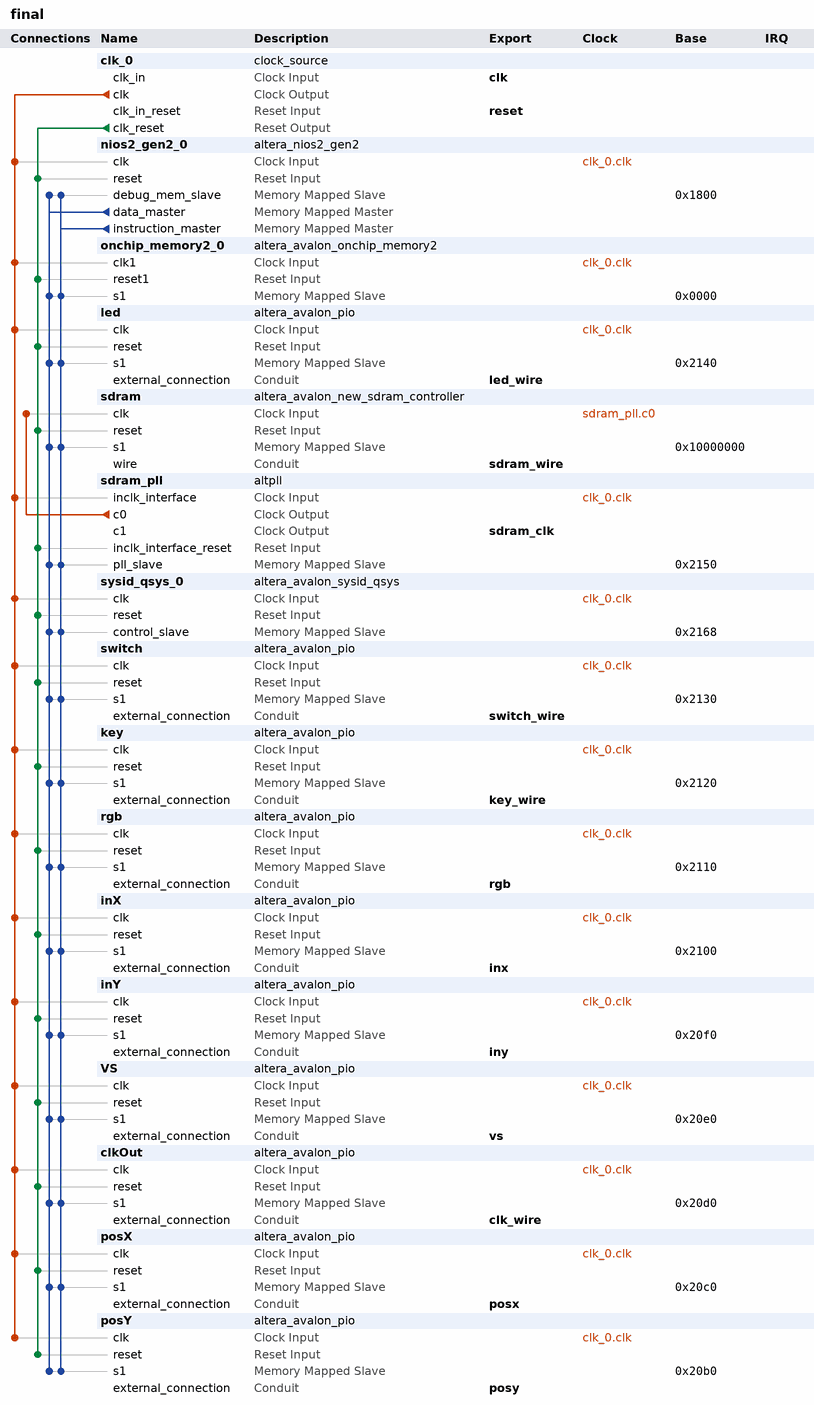
[diagram p0: system contents]
# Platform Designer (Qsys) system final, Cyclone IV E EP4CE115F29C7
# Parameters at their usual value, and those the tool derives, are not listed.
package require -exact qsys 16.1
create_system final
set_project_property DEVICE_FAMILY {Cyclone IV E}
set_project_property DEVICE EP4CE115F29C7

add_instance clk_0 clock_source 16.1
set_instance_parameter_value clk_0 clockFrequency 50000000

add_instance nios2_gen2_0 altera_nios2_gen2 16.1
set_instance_parameter_value nios2_gen2_0 dcache_size 2048
set_instance_parameter_value nios2_gen2_0 exceptionSlave sdram.s1
set_instance_parameter_value nios2_gen2_0 icache_size 4096
set_instance_parameter_value nios2_gen2_0 impl Tiny
set_instance_parameter_value nios2_gen2_0 resetSlave sdram.s1

add_instance onchip_memory2_0 altera_avalon_onchip_memory2 16.1
set_instance_parameter_value onchip_memory2_0 dataWidth 32
set_instance_parameter_value onchip_memory2_0 dualPort false
set_instance_parameter_value onchip_memory2_0 initMemContent true
set_instance_parameter_value onchip_memory2_0 initializationFileName onchip_mem.hex
set_instance_parameter_value onchip_memory2_0 memorySize 4096

add_instance led altera_avalon_pio 16.1
set_instance_parameter_value led direction Output
set_instance_parameter_value led width 8

add_instance sdram altera_avalon_new_sdram_controller 16.1
set_instance_parameter_value sdram TAC 5.5
set_instance_parameter_value sdram TRCD 20.0
set_instance_parameter_value sdram TRP 20.0
set_instance_parameter_value sdram casLatency 3
set_instance_parameter_value sdram columnWidth 10
set_instance_parameter_value sdram dataWidth 32
set_instance_parameter_value sdram generateSimulationModel false
set_instance_parameter_value sdram model single_Micron_MT48LC4M32B2_7_chip
set_instance_parameter_value sdram numberOfBanks 4
set_instance_parameter_value sdram numberOfChipSelects 1
set_instance_parameter_value sdram powerUpDelay 200.0
set_instance_parameter_value sdram refreshPeriod 7.8125
set_instance_parameter_value sdram rowWidth 13

add_instance sdram_pll altpll 16.1
set_instance_parameter_value sdram_pll CLK0_DIVIDE_BY 1
set_instance_parameter_value sdram_pll CLK0_MULTIPLY_BY 1
set_instance_parameter_value sdram_pll CLK1_DIVIDE_BY 1
set_instance_parameter_value sdram_pll CLK1_DUTY_CYCLE 50
set_instance_parameter_value sdram_pll CLK1_MULTIPLY_BY 1
set_instance_parameter_value sdram_pll CLK1_PHASE_SHIFT -3000
set_instance_parameter_value sdram_pll INCLK0_INPUT_FREQUENCY 20000
set_instance_parameter_value sdram_pll PORT_ARESET PORT_UNUSED
set_instance_parameter_value sdram_pll PORT_LOCKED PORT_UNUSED
set_instance_parameter_value sdram_pll PORT_clk1 PORT_USED
set_instance_parameter_value sdram_pll PORT_clk2 PORT_UNUSED
set_instance_parameter_value sdram_pll PORT_clk3 PORT_UNUSED

add_instance sysid_qsys_0 altera_avalon_sysid_qsys 16.1
set_instance_parameter_value sysid_qsys_0 id 0

add_instance switch altera_avalon_pio 16.1
set_instance_parameter_value switch direction Input
set_instance_parameter_value switch width 8

add_instance key altera_avalon_pio 16.1
set_instance_parameter_value key direction Input
set_instance_parameter_value key width 4

add_instance rgb altera_avalon_pio 16.1
set_instance_parameter_value rgb direction Input
set_instance_parameter_value rgb width 30

add_instance inX altera_avalon_pio 16.1
set_instance_parameter_value inX direction Input
set_instance_parameter_value inX width 10

add_instance inY altera_avalon_pio 16.1
set_instance_parameter_value inY direction Input
set_instance_parameter_value inY width 10

add_instance VS altera_avalon_pio 16.1
set_instance_parameter_value VS direction Input
set_instance_parameter_value VS width 1

add_instance clkOut altera_avalon_pio 16.1
set_instance_parameter_value clkOut direction Output
set_instance_parameter_value clkOut width 1

add_instance posX altera_avalon_pio 16.1
set_instance_parameter_value posX direction Output
set_instance_parameter_value posX width 10

add_instance posY altera_avalon_pio 16.1
set_instance_parameter_value posY direction Output
set_instance_parameter_value posY width 10

# connections
add_connection clk_0.clk clkOut.clk clock
add_connection clk_0.clk inX.clk clock
add_connection clk_0.clk inY.clk clock
add_connection clk_0.clk key.clk clock
add_connection clk_0.clk led.clk clock
add_connection clk_0.clk nios2_gen2_0.clk clock
add_connection clk_0.clk onchip_memory2_0.clk1 clock
add_connection clk_0.clk posX.clk clock
add_connection clk_0.clk posY.clk clock
add_connection clk_0.clk rgb.clk clock
add_connection clk_0.clk sdram_pll.inclk_interface clock
add_connection clk_0.clk switch.clk clock
add_connection clk_0.clk sysid_qsys_0.clk clock
add_connection clk_0.clk VS.clk clock
add_connection sdram_pll.c0 sdram.clk clock
add_connection clk_0.clk_reset clkOut.reset reset
add_connection clk_0.clk_reset inX.reset reset
add_connection clk_0.clk_reset inY.reset reset
add_connection clk_0.clk_reset key.reset reset
add_connection clk_0.clk_reset led.reset reset
add_connection clk_0.clk_reset nios2_gen2_0.reset reset
add_connection clk_0.clk_reset onchip_memory2_0.reset1 reset
add_connection clk_0.clk_reset posX.reset reset
add_connection clk_0.clk_reset posY.reset reset
add_connection clk_0.clk_reset rgb.reset reset
add_connection clk_0.clk_reset sdram.reset reset
add_connection clk_0.clk_reset sdram_pll.inclk_interface_reset reset
add_connection clk_0.clk_reset switch.reset reset
add_connection clk_0.clk_reset sysid_qsys_0.reset reset
add_connection clk_0.clk_reset VS.reset reset
add_connection nios2_gen2_0.data_master clkOut.s1 avalon
set_connection_parameter_value nios2_gen2_0.data_master/clkOut.s1 baseAddress 0x20d0
add_connection nios2_gen2_0.data_master inX.s1 avalon
set_connection_parameter_value nios2_gen2_0.data_master/inX.s1 baseAddress 0x2100
add_connection nios2_gen2_0.data_master inY.s1 avalon
set_connection_parameter_value nios2_gen2_0.data_master/inY.s1 baseAddress 0x20f0
add_connection nios2_gen2_0.data_master key.s1 avalon
set_connection_parameter_value nios2_gen2_0.data_master/key.s1 baseAddress 0x2120
add_connection nios2_gen2_0.data_master led.s1 avalon
set_connection_parameter_value nios2_gen2_0.data_master/led.s1 baseAddress 0x2140
add_connection nios2_gen2_0.data_master nios2_gen2_0.debug_mem_slave avalon
set_connection_parameter_value nios2_gen2_0.data_master/nios2_gen2_0.debug_mem_slave baseAddress 0x1800
add_connection nios2_gen2_0.data_master onchip_memory2_0.s1 avalon
set_connection_parameter_value nios2_gen2_0.data_master/onchip_memory2_0.s1 baseAddress 0x0000
add_connection nios2_gen2_0.data_master posX.s1 avalon
set_connection_parameter_value nios2_gen2_0.data_master/posX.s1 baseAddress 0x20c0
add_connection nios2_gen2_0.data_master posY.s1 avalon
set_connection_parameter_value nios2_gen2_0.data_master/posY.s1 baseAddress 0x20b0
add_connection nios2_gen2_0.data_master rgb.s1 avalon
set_connection_parameter_value nios2_gen2_0.data_master/rgb.s1 baseAddress 0x2110
add_connection nios2_gen2_0.data_master sdram.s1 avalon
set_connection_parameter_value nios2_gen2_0.data_master/sdram.s1 baseAddress 0x10000000
add_connection nios2_gen2_0.data_master sdram_pll.pll_slave avalon
set_connection_parameter_value nios2_gen2_0.data_master/sdram_pll.pll_slave baseAddress 0x2150
add_connection nios2_gen2_0.data_master switch.s1 avalon
set_connection_parameter_value nios2_gen2_0.data_master/switch.s1 baseAddress 0x2130
add_connection nios2_gen2_0.data_master sysid_qsys_0.control_slave avalon
set_connection_parameter_value nios2_gen2_0.data_master/sysid_qsys_0.control_slave baseAddress 0x2168
add_connection nios2_gen2_0.data_master VS.s1 avalon
set_connection_parameter_value nios2_gen2_0.data_master/VS.s1 baseAddress 0x20e0
add_connection nios2_gen2_0.instruction_master clkOut.s1 avalon
set_connection_parameter_value nios2_gen2_0.instruction_master/clkOut.s1 baseAddress 0x20d0
add_connection nios2_gen2_0.instruction_master inX.s1 avalon
set_connection_parameter_value nios2_gen2_0.instruction_master/inX.s1 baseAddress 0x2100
add_connection nios2_gen2_0.instruction_master inY.s1 avalon
set_connection_parameter_value nios2_gen2_0.instruction_master/inY.s1 baseAddress 0x20f0
add_connection nios2_gen2_0.instruction_master key.s1 avalon
set_connection_parameter_value nios2_gen2_0.instruction_master/key.s1 baseAddress 0x2120
add_connection nios2_gen2_0.instruction_master led.s1 avalon
set_connection_parameter_value nios2_gen2_0.instruction_master/led.s1 baseAddress 0x2140
add_connection nios2_gen2_0.instruction_master nios2_gen2_0.debug_mem_slave avalon
set_connection_parameter_value nios2_gen2_0.instruction_master/nios2_gen2_0.debug_mem_slave baseAddress 0x1800
add_connection nios2_gen2_0.instruction_master onchip_memory2_0.s1 avalon
set_connection_parameter_value nios2_gen2_0.instruction_master/onchip_memory2_0.s1 baseAddress 0x0000
add_connection nios2_gen2_0.instruction_master posX.s1 avalon
set_connection_parameter_value nios2_gen2_0.instruction_master/posX.s1 baseAddress 0x20c0
add_connection nios2_gen2_0.instruction_master posY.s1 avalon
set_connection_parameter_value nios2_gen2_0.instruction_master/posY.s1 baseAddress 0x20b0
add_connection nios2_gen2_0.instruction_master rgb.s1 avalon
set_connection_parameter_value nios2_gen2_0.instruction_master/rgb.s1 baseAddress 0x2110
add_connection nios2_gen2_0.instruction_master sdram.s1 avalon
set_connection_parameter_value nios2_gen2_0.instruction_master/sdram.s1 baseAddress 0x10000000
add_connection nios2_gen2_0.instruction_master sdram_pll.pll_slave avalon
set_connection_parameter_value nios2_gen2_0.instruction_master/sdram_pll.pll_slave baseAddress 0x2150
add_connection nios2_gen2_0.instruction_master switch.s1 avalon
set_connection_parameter_value nios2_gen2_0.instruction_master/switch.s1 baseAddress 0x2130
add_connection nios2_gen2_0.instruction_master sysid_qsys_0.control_slave avalon
set_connection_parameter_value nios2_gen2_0.instruction_master/sysid_qsys_0.control_slave baseAddress 0x2168
add_connection nios2_gen2_0.instruction_master VS.s1 avalon
set_connection_parameter_value nios2_gen2_0.instruction_master/VS.s1 baseAddress 0x20e0

# exported interfaces
add_interface clk clock sink
set_interface_property clk EXPORT_OF clk_0.clk_in
add_interface clk_wire conduit end
set_interface_property clk_wire EXPORT_OF clkOut.external_connection
add_interface inx conduit end
set_interface_property inx EXPORT_OF inX.external_connection
add_interface iny conduit end
set_interface_property iny EXPORT_OF inY.external_connection
add_interface key_wire conduit end
set_interface_property key_wire EXPORT_OF key.external_connection
add_interface led_wire conduit end
set_interface_property led_wire EXPORT_OF led.external_connection
add_interface posx conduit end
set_interface_property posx EXPORT_OF posX.external_connection
add_interface posy conduit end
set_interface_property posy EXPORT_OF posY.external_connection
add_interface reset reset sink
set_interface_property reset EXPORT_OF clk_0.clk_in_reset
add_interface rgb conduit end
set_interface_property rgb EXPORT_OF rgb.external_connection
add_interface sdram_clk clock source
set_interface_property sdram_clk EXPORT_OF sdram_pll.c1
add_interface sdram_wire conduit end
set_interface_property sdram_wire EXPORT_OF sdram.wire
add_interface switch_wire conduit end
set_interface_property switch_wire EXPORT_OF switch.external_connection
add_interface vs conduit end
set_interface_property vs EXPORT_OF VS.external_connection

set_interconnect_requirement {$system} qsys_mm.clockCrossingAdapter HANDSHAKE
set_interconnect_requirement {$system} qsys_mm.enableEccProtection FALSE
set_interconnect_requirement {$system} qsys_mm.insertDefaultSlave FALSE
set_interconnect_requirement {$system} qsys_mm.maxAdditionalLatency 1

save_system final.qsys
